# Altium schematic sheet SCH001.SchDoc: Controller
size A4; Date: 07-02-2024; CompanyName: Confederation College; DrawnBy: Nikhil Premjani; SheetNumber: 1; SheetTotal: 6; Model: Remote Manipulation Controller; ModelNumber: EM411-202401-RMC001; ModelName: Remote Manipulation Controller
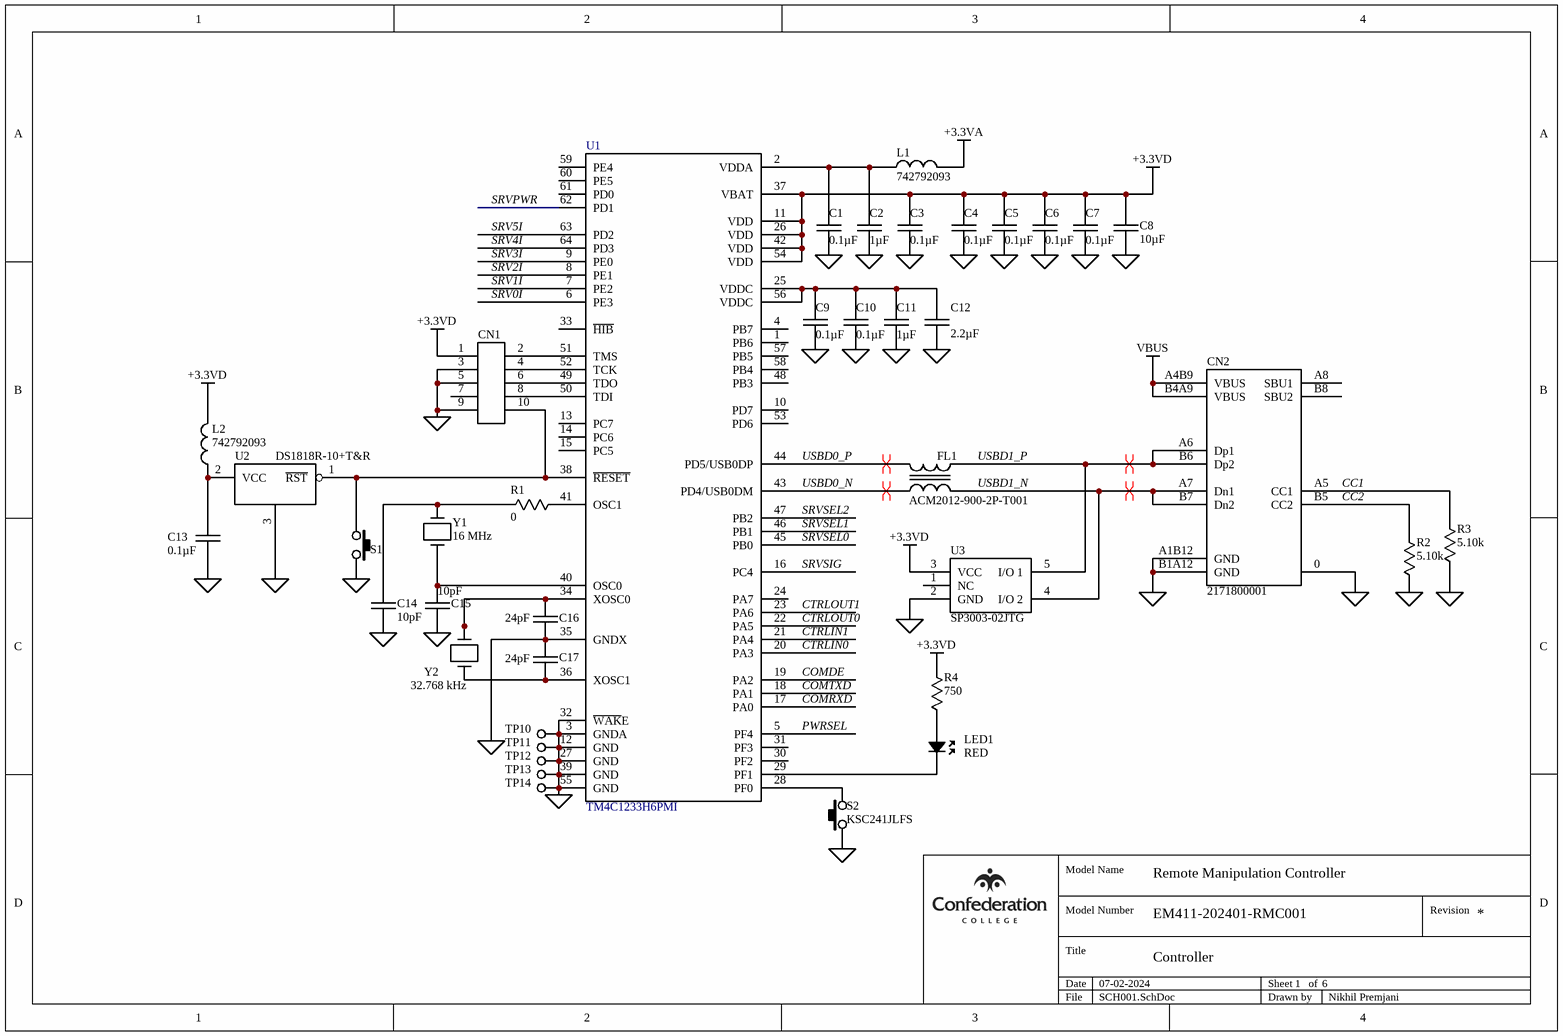
[diagram p0: SCH001.SchDoc]

## Parts
C1  0.1µF  [CAPC2012X14N]
C2  1µF  [CAPC2012X14N]
C3  0.1µF  [CAPC2012X14N]
C4  0.1µF  [CAPC2012X14N]
C5  0.1µF  [CAPC2012X14N]
C6  0.1µF  [CAPC2012X14N]
C7  0.1µF  [CAPC2012X14N]
C8  10µF  [CAPC2012X14N]
C9  0.1µF  [CAPC2012X14N]
C10  0.1µF  [CAPC2012X14N]
C11  1µF  [CAPC2012X14N]
C12  2.2µF  [CAPC2012X14N]
C13  0.1µF  [CAPC2012X14N]
C14  10pF  [CAPC2012X09N]
C15  10pF  [CAPC2012X09N]
C16  24pF  [CAPC2012X09N]
C17  24pF  [CAPC2012X09N]
CN1  GRPB052VWVN-RC  [SULLINS_GRPB052VWVN-RC]  (value not drawn)
CN2  2171800001  [MOLEX_2171800001]
FL1  ACM2012-900-2P-T001  [LITTELFUSE_ACM2012-900-2P-T001]
L1  742792093  [INDC2012X11N]
L2  742792093  [INDC2012X11N]
LED1  RED  [LEDM3228X19N]
R1  0  [VISHAY_RESC2012X06N]
R2  5.10k  [RESC2012X06N]
R3  5.10k  [RESC2012X06N]
R4  750  [RESC2012X06N]
S1  KSC241JLFS  [CK_KSC241JLFS]  (value not drawn)
S2  KSC241JLFS  [CK_KSC241JLFS]
TP10  Test Point  [TP100]  (value not drawn)  (no BOM)
TP11  Test Point  [TP100]  (value not drawn)  (no BOM)
TP12  Test Point  [TP100]  (value not drawn)  (no BOM)
TP13  Test Point  [TP100]  (value not drawn)  (no BOM)
TP14  Test Point  [TP100]  (value not drawn)  (no BOM)
U1  TM4C1233H6PMI  [TSQFP50P1200X1200X145-64N]
U2  DS1818R-10+T&R  [SOT95P237X112-3N]
U3  SP3003-02JTG  [SOT65P220X110-5N]
Y1  16 MHz  [ABRACON_ABM3]
Y2  32.768 kHz  [ABRACON_AB26TRB]

## Nets
+3.3VA: L1.2
+3.3VD: C3.1 C4.1 C5.1 C6.1 C7.1 C8.1 CN1.1 L2.2 R4.2 U1.11(VDD) U1.26(VDD) U1.37(VBAT) U1.42(VDD) U1.54(VDD) U3.3(VCC)
GND: C1.2 C2.2 C3.2 C4.2 C5.2 C6.2 C7.2 C8.2 C9.2 C10.2 C11.2 C12.2 C13.2 C14.2 C15.2 C16.2 C17.1 CN1.3 CN1.5 CN1.9 CN2.0 CN2.A1B12(GND) CN2.B1A12(GND) R2.1 R3.1 S1.1 S2.2 TP10.1 TP11.1 TP12.1 TP13.1 TP14.1 U1.3(GNDA) U1.12(GND) U1.27(GND) U1.32(~{WAK}E) U1.35(GNDX) U1.39(GND) U1.55(GND) U2.3(GND) U3.2(GND)
VBUS: CN2.A4B9(VBUS) CN2.B4A9(VBUS)
CC1: CN2.A5(CC1) R3.2
CC2: CN2.B5(CC2) R2.2
COMDE: U1.19(PA2)
COMRXD: U1.17(PA0)
COMTXD: U1.18(PA1)
CTRLIN0: U1.20(PA3)
CTRLIN1: U1.21(PA4)
CTRLOUT0: U1.22(PA5)
CTRLOUT1: U1.23(PA6)
PWRSEL: U1.5(PF4)
SRV0I: U1.6(PE3)
SRV1I: U1.7(PE2)
SRV2I: U1.8(PE1)
SRV3I: U1.9(PE0)
SRV4I: U1.64(PD3)
SRV5I: U1.63(PD2)
SRVPWR: U1.62(PD1)
SRVSEL0: U1.45(PB0)
SRVSEL1: U1.46(PB1)
SRVSEL2: U1.47(PB2)
SRVSIG: U1.16(PC4)
USBD0_N: FL1.2 U1.43(PD4/USB0DM)
USBD0_P: FL1.1 U1.44(PD5/USB0DP)
USBD1_N: CN2.A7(Dn1) CN2.B7(Dn2) FL1.3 U3.4(I/O_2)
USBD1_P: CN2.A6(Dp1) CN2.B6(Dp2) FL1.4 U3.5(I/O_1)
NetC1_1: C1.1 C2.1 L1.1 U1.2(VDDA)
NetC9_1: C9.1 C10.1 C11.1 C12.1 U1.25(VDDC) U1.56(VDDC)
NetC13_1: C13.1 L2.1 U2.2(VCC)
NetC14_1: C14.1 R1.1 Y1.1
NetC15_1: C15.1 U1.40(OSC0) Y1.2
NetC16_1: C16.1 U1.34(XOSC0) Y2.2
NetC17_2: C17.2 U1.36(XOSC1) Y2.1
NetCN1_2: CN1.2 U1.51(TMS)
NetCN1_4: CN1.4 U1.52(TCK)
NetCN1_6: CN1.6 U1.49(TDO)
NetCN1_8: CN1.8 U1.50(TDI)
NetCN1_10: CN1.10 S1.2 U1.38(~{RESET}) U2.1(~{RST})
NetLED1_A: LED1.A R4.1
NetLED1_K: LED1.K U1.29(PF1)
NetR1_2: R1.2 U1.41(OSC1)
NetS2_1: S2.1 U1.28(PF0)

Not connected (* = marked no-connect by the designer): CN1 7; CN2 A8(SBU1) B8(SBU2); U1 1(PB6) 4(PB7) 10(PD7) 13(PC7) 14(PC6) 15(PC5) 24(PA7) 30(PF2) 31(PF3) 33(~{HIB}) 48(PB3) 53(PD6) 57(PB5) 58(PB4) 59(PE4) 60(PE5) 61(PD0); U3 1(NC)

## Layout directives
differential pair; differential pair class USB: USBD0_N, USBD0_P, USBD1_N, USBD1_P

## Notes on the sheet
- Model Number
- Model Name
- Revision
- Title
- Date
- Sheet
- of
- File
- Drawn by

## Library data of the parts
C1 C3-C7 C9 C10 C13 = UMK212B7104KGHT: 0.1µF/50V/±10% X7R Ceramic Chip Capacitor; Manufacturer: Taiyo Yuden; PartNumber: UMK212B7104KGHT
C2 C11 = CL21B105KBFNNNG: 1µF/50V/±10% X7R Ceramic Chip Capacitor; Manufacturer: Samsung Electro-Mechanics; PartNumber: CL21B105KBFNNNG
C8 = CL21A106KAFN3NE: 10µF/25V 10% X5R Multi-Layer Ceramic Capacitor; Manufacturer: Samsung Electro-Mechanics; PartNumber: CL21A106KAFN3NE
C12 = UMK212BB7225KG-T: 2.2µF/50V/10% Multilayer Ceramic Chip Capacitor; Manufacturer: Taiyo Yuden; PartNumber: UMK212BB7225KG-T
C14 C15 = 08051A100KAT: 10pF/100V/±10% C0G (NP0) Ceramic Chip Capacitor; Manufacturer: Kyocera/AVX; PartNumber: 08051A100KAT
C16 C17 = 08055A240JAT: 24pF/50V/±5% C0G (NP0) Ceramic Chip Capacitor; Manufacturer: Kyocera/AVX; PartNumber: 08055A240JAT
CN1 = GRPB052VWVN-RC: .050"[1.27mm] Contact Centers, Male Header; Manufacturer: Sullins Connector Solutions, Inc.; PartNumber: GRPB052VWVN-RC
CN2 = 2171800001: USB-C Receptacle, Right-Angle, Surface Mount, Top Mount, Center Height 5.9mm, Single Row, 16 Circuits; Manufacturer: Molex; PartNumber: 2171800001
FL1 = ACM2012-900-2P-T001: Common Mode Filter; Manufacturer: TDK; PartNumber: ACM2012-900-2P-T001
L1 L2 = 742792093: Multilayer SMD Ferrite; Manufacturer: Wurth Elektronik; PartNumber: 742792093
LED1 = 597-3008-207F: Micro LED, 597 Series, Red, SMD LED; Manufacturer: Dialight Corporation; PartNumber: 597-3008-207F
R1 = CRCW08050000Z0EAHP: 0, Jumper, Pulse Proof, High Power Thick Film Chip Resistor; Manufacturer: Vishay Intertechnology; PartNumber: CRCW08050000Z0EAHP
R2 R3 = CR0805-FX-5101ELF: 5.10k, 1%, 0.125W Thick Film Chip Resistor; Manufacturer: Bourns; PartNumber: CR0805-FX-4421ELF
R4 = CR0805-FX-7500ELF: 750, 1%, 0.125W Thick Film Chip Resistor; Manufacturer: Bourns; PartNumber: CR0805-FX-7500ELF
S1 S2 = KSC241JLFS: KSC Series Sealed Tact Switch for SMT; Manufacturer: C&K Components; PartNumber: KSC241JLFS
TP10-TP14 = TP3: Test Point, Surface Mount, 3 mm; Manufacturer: Confederation College; PartNumber: N/A
U1 = TM4C1233H6PMI: Microcontroller; Manufacturer: Texas Instruments; PartNumber: TM4C1233H6PMI
U2 = DS1818R-10+T&R: 3.3 V EconoReset with Pushbutton; Manufacturer: Maxim Integrated; PartNumber: DS1818R-10+T&R
U3 = SP3003-02JTG: TVS Diode Array - Low Capacitance ESD Protection; Manufacturer: Littelfuse; PartNumber: SP3003-02JTG
Y1 = ABM3-16.000MHZ-B2-T: 16 MHz Miniature Ceramic SMD Crystal; Manufacturer: Abracon Corporation; PartNumber: ABM3-16.000MHZ-B2-T
Y2 = AB26TRB-32.768KHZ-T: 32.768 kHz Radial Can Crystal; Manufacturer: Abracon Corporation; PartNumber: AB26TRB-32.768KHZ-T